# EasyEDA schematic SCH_Funkypad.json
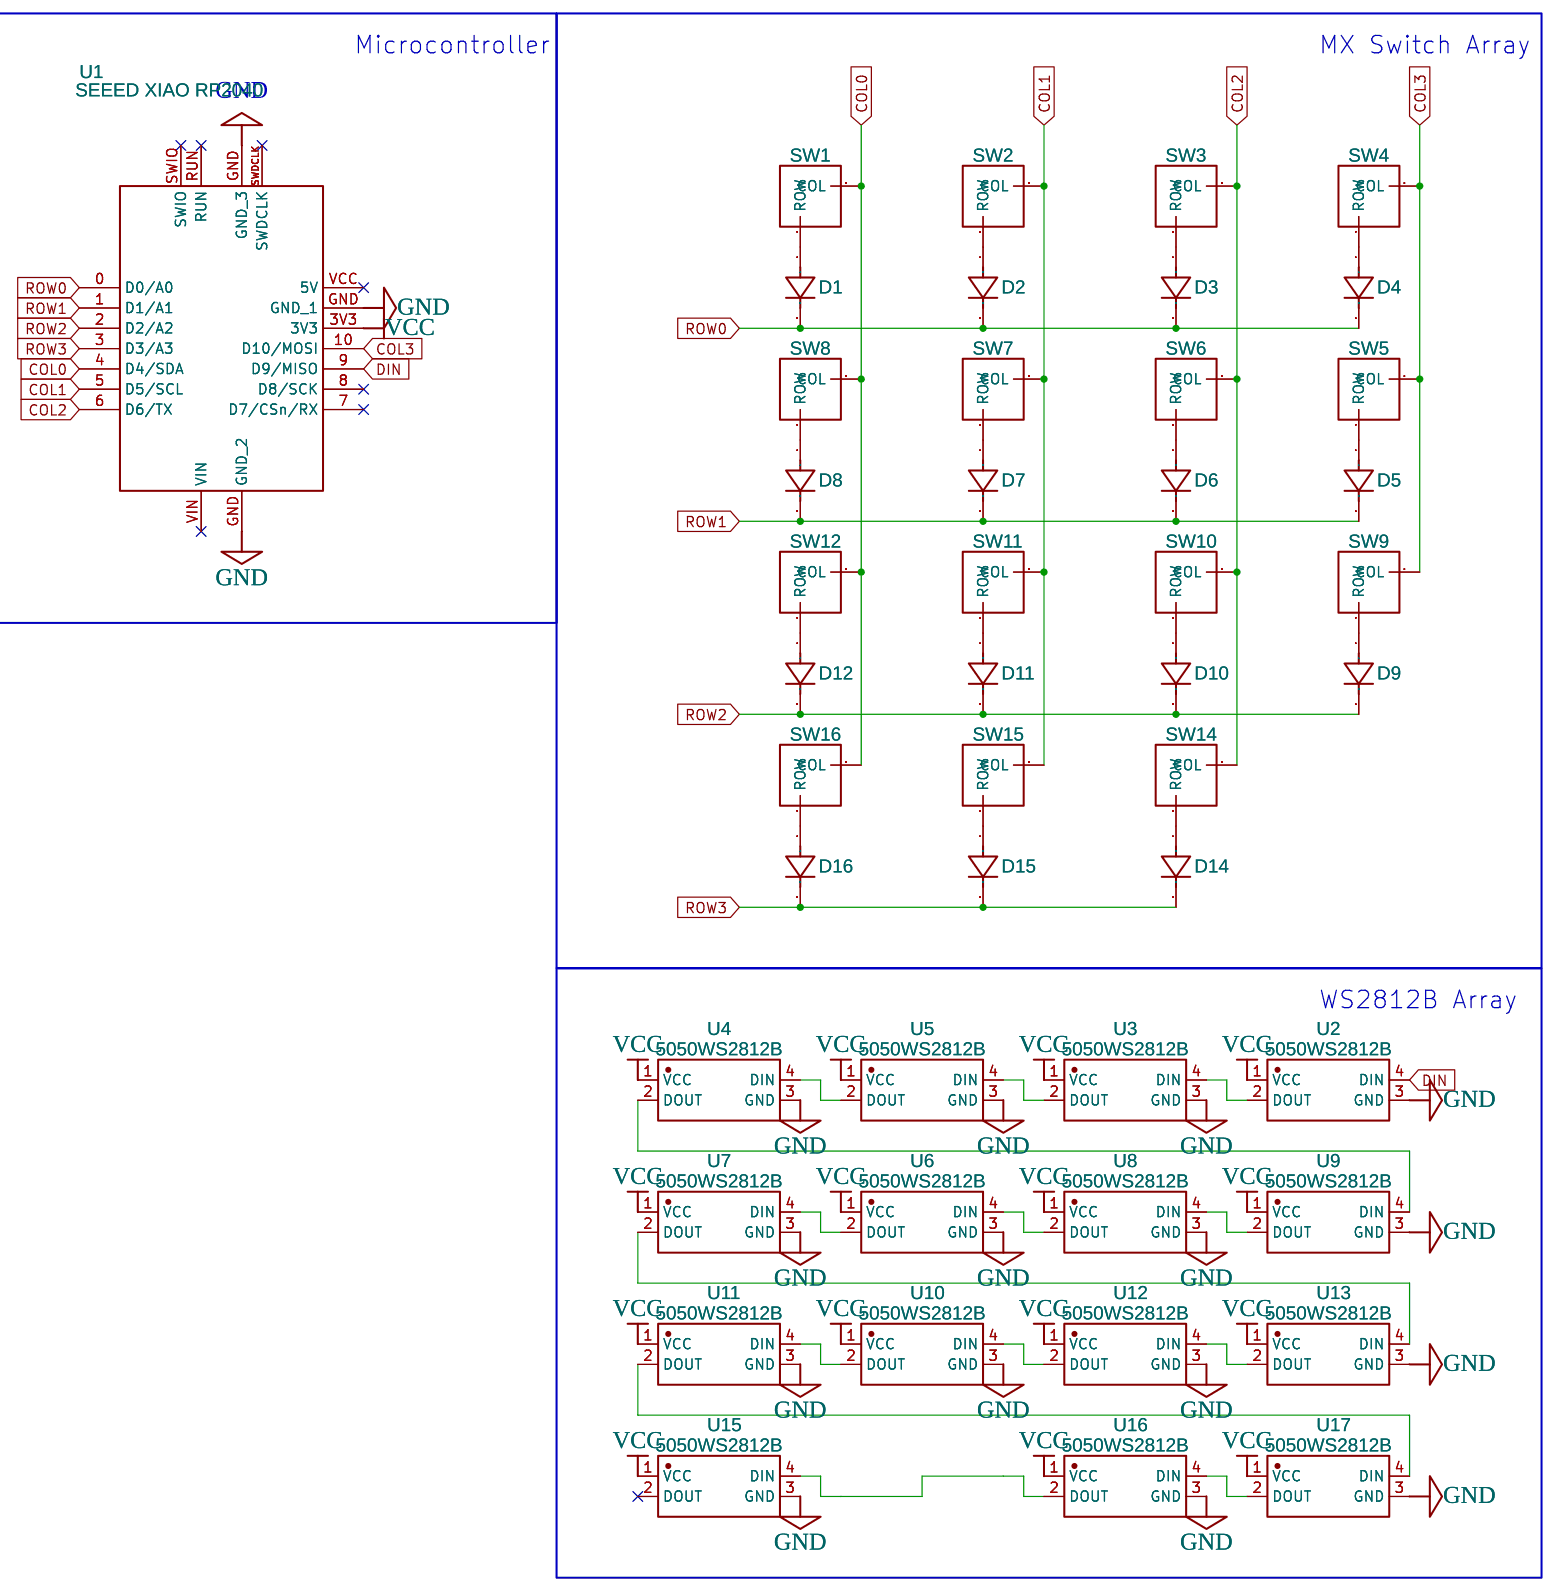
[diagram p0: schematic sheet]

## Parts
D1  1N4148_C18195411  [DO-35_BD2.2-L4.0-D0.50_1N4148]
D2  1N4148_C18195411  [DO-35_BD2.2-L4.0-D0.50_1N4148]
D3  1N4148_C18195411  [DO-35_BD2.2-L4.0-D0.50_1N4148]
D4  1N4148_C18195411  [DO-35_BD2.2-L4.0-D0.50_1N4148]
D5  1N4148_C18195411  [DO-35_BD2.2-L4.0-D0.50_1N4148]
D6  1N4148_C18195411  [DO-35_BD2.2-L4.0-D0.50_1N4148]
D7  1N4148_C18195411  [DO-35_BD2.2-L4.0-D0.50_1N4148]
D8  1N4148_C18195411  [DO-35_BD2.2-L4.0-D0.50_1N4148]
D9  1N4148_C18195411  [DO-35_BD2.2-L4.0-D0.50_1N4148]
D10  1N4148_C18195411  [DO-35_BD2.2-L4.0-D0.50_1N4148]
D11  1N4148_C18195411  [DO-35_BD2.2-L4.0-D0.50_1N4148]
D12  1N4148_C18195411  [DO-35_BD2.2-L4.0-D0.50_1N4148]
D14  1N4148_C18195411  [DO-35_BD2.2-L4.0-D0.50_1N4148]
D15  1N4148_C18195411  [DO-35_BD2.2-L4.0-D0.50_1N4148]
D16  1N4148_C18195411  [DO-35_BD2.2-L4.0-D0.50_1N4148]
SW1  CHERRY MX SWITCH 1.0U  [CHERRY MX SWITCH 1.0U]
SW2  CHERRY MX SWITCH 1.0U  [CHERRY MX SWITCH 1.0U]
SW3  CHERRY MX SWITCH 1.0U  [CHERRY MX SWITCH 1.0U]
SW4  CHERRY MX SWITCH 1.0U  [CHERRY MX SWITCH 1.0U]
SW5  CHERRY MX SWITCH 1.0U  [CHERRY MX SWITCH 1.0U]
SW6  CHERRY MX SWITCH 1.0U  [CHERRY MX SWITCH 1.0U]
SW7  CHERRY MX SWITCH 1.0U  [CHERRY MX SWITCH 1.0U]
SW8  CHERRY MX SWITCH 1.0U  [CHERRY MX SWITCH 1.0U]
SW9  CHERRY MX SWITCH 1.0U  [CHERRY MX SWITCH 1.0U]
SW10  CHERRY MX SWITCH 1.0U  [CHERRY MX SWITCH 1.0U]
SW11  CHERRY MX SWITCH 1.0U  [CHERRY MX SWITCH 1.0U]
SW12  CHERRY MX SWITCH 1.0U  [CHERRY MX SWITCH 1.0U]
SW14  CHERRY MX SWITCH 1.0U  [CHERRY MX SWITCH 1.0U]
SW15  CHERRY MX SWITCH 1.0U  [CHERRY MX SWITCH 1.0U]
SW16  CHERRY MX SWITCH 1.0U  [CHERRY MX SWITCH 1.0U]
U1  SEEED XIAO RP2040  [XIAO RP2040 V1.22_BOARD]
U2  5050WS2812B  [LED-SMD_5050WS2812B]
U3  5050WS2812B  [LED-SMD_5050WS2812B]
U4  5050WS2812B  [LED-SMD_5050WS2812B]
U5  5050WS2812B  [LED-SMD_5050WS2812B]
U6  5050WS2812B  [LED-SMD_5050WS2812B]
U7  5050WS2812B  [LED-SMD_5050WS2812B]
U8  5050WS2812B  [LED-SMD_5050WS2812B]
U9  5050WS2812B  [LED-SMD_5050WS2812B]
U10  5050WS2812B  [LED-SMD_5050WS2812B]
U11  5050WS2812B  [LED-SMD_5050WS2812B]
U12  5050WS2812B  [LED-SMD_5050WS2812B]
U13  5050WS2812B  [LED-SMD_5050WS2812B]
U15  5050WS2812B  [LED-SMD_5050WS2812B]
U16  5050WS2812B  [LED-SMD_5050WS2812B]
U17  5050WS2812B  [LED-SMD_5050WS2812B]

## Library data of the parts
D1-D12 D14-D16 = 1N4148_C18195411: Supplier: LCSC; Supplier Part: C18195411; Manufacturer: LJ(朗捷); Manufacturer Part: 1N4148; JLCPCB Part Class: Extended Part; Contributor: lcsc
SW1-SW12 SW14-SW16 = CHERRY MX SWITCH 1.0U: Manufacturer Part: Cherry; Supplier Part: CH310-ND; Supplier: Digi-Key; Contributor: logan.howard.macfarl
U1 = SEEED XIAO RP2040: Contributor: smartdude
U2-U13 U15-U17 = 5050WS2812B: Contributor: LCSC; Supplier: LCSC; Supplier Part: C2874876; Manufacturer: null; JLCPCB Part Class: Extended Part

## Nets
GND: U1.GND(GND_3) U2.3(GND) U3.3(GND) U4.3(GND) U5.3(GND) U6.3(GND) U7.3(GND) U8.3(GND) U9.3(GND) U10.3(GND) U11.3(GND) U12.3(GND) U13.3(GND) U15.3(GND) U16.3(GND) U17.3(GND)
VCC: U1.3V3 U2.1(VCC) U3.1(VCC) U4.1(VCC) U5.1(VCC) U6.1(VCC) U7.1(VCC) U8.1(VCC) U9.1(VCC) U10.1(VCC) U11.1(VCC) U12.1(VCC) U13.1(VCC) U15.1(VCC) U16.1(VCC) U17.1(VCC)
COL0: SW1.C(COL) SW8.C(COL) SW12.C(COL) SW16.C(COL) U1.4(D4/SDA)
COL1: SW2.C(COL) SW7.C(COL) SW11.C(COL) SW15.C(COL) U1.5(D5/SCL)
COL2: SW3.C(COL) SW6.C(COL) SW10.C(COL) SW14.C(COL) U1.6(D6/TX)
COL3: SW4.C(COL) SW5.C(COL) SW9.C(COL) U1.10(D10/MOSI)
DIN: U1.9(D9/MISO) U2.4(DIN)
ROW0: D1.2(C) D2.2(C) D3.2(C) D4.2(C) U1.0(D0/A0)
ROW1: D5.2(C) D6.2(C) D7.2(C) D8.2(C) U1.1(D1/A1)
ROW2: D9.2(C) D10.2(C) D11.2(C) D12.2(C) U1.2(D2/A2)
ROW3: D14.2(C) D15.2(C) D16.2(C) U1.3(D3/A3)
Net-(D1-1): D1.1(A) SW1.R(ROW)
Net-(D2-1): D2.1(A) SW2.R(ROW)
Net-(D3-1): D3.1(A) SW3.R(ROW)
Net-(D4-1): D4.1(A) SW4.R(ROW)
Net-(D5-1): D5.1(A) SW5.R(ROW)
Net-(D6-1): D6.1(A) SW6.R(ROW)
Net-(D7-1): D7.1(A) SW7.R(ROW)
Net-(D8-1): D8.1(A) SW8.R(ROW)
Net-(D9-1): D9.1(A) SW9.R(ROW)
Net-(D10-1): D10.1(A) SW10.R(ROW)
Net-(D11-1): D11.1(A) SW11.R(ROW)
Net-(D12-1): D12.1(A) SW12.R(ROW)
Net-(D14-1): D14.1(A) SW14.R(ROW)
Net-(D15-1): D15.1(A) SW15.R(ROW)
Net-(D16-1): D16.1(A) SW16.R(ROW)
Net-(U2-2): U2.2(DOUT) U3.4(DIN)
Net-(U3-2): U3.2(DOUT) U5.4(DIN)
Net-(U4-2): U4.2(DOUT) U9.4(DIN)
Net-(U4-4): U4.4(DIN) U5.2(DOUT)
Net-(U6-2): U6.2(DOUT) U7.4(DIN)
Net-(U6-4): U6.4(DIN) U8.2(DOUT)
Net-(U7-2): U7.2(DOUT) U13.4(DIN)
Net-(U8-4): U8.4(DIN) U9.2(DOUT)
Net-(U10-2): U10.2(DOUT) U11.4(DIN)
Net-(U10-4): U10.4(DIN) U12.2(DOUT)
Net-(U11-2): U11.2(DOUT) U17.4(DIN)
Net-(U12-4): U12.4(DIN) U13.2(DOUT)
Net-(U15-4): U15.4(DIN) U16.2(DOUT)
Net-(U16-4): U16.4(DIN) U17.2(DOUT)

Not connected (* = marked no-connect by the designer): U1 7(D7/CSn/RX)* 8(D8/SCK)* RUN* SWDCLK* SWIO* VCC(5V)* VIN*; U15 2(DOUT)*

## Notes on the sheet
- Microcontroller
- MX Switch Array
- WS2812B Array
